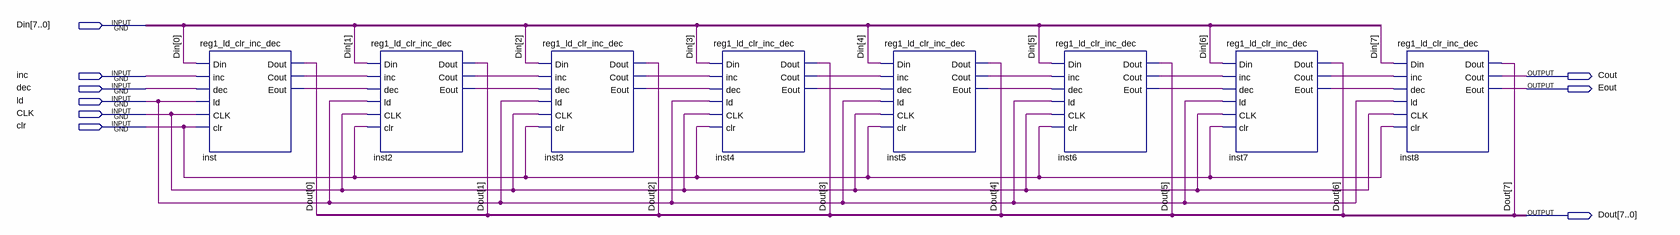
[diagram p0: schematic sheet]
// Quartus schematic reg8_ld_clr_inc_dec.bdf as structural Verilog: 8 symbols, 9 pins
module reg8_ld_clr_inc_dec (
  input  [7:0] Din,
  input  inc,
  input  dec,
  input  ld,
  input  CLK,
  input  clr,
  output Cout,
  output Eout,
  output [7:0] Dout
);

  wire inst2_cout, inst2_eout, inst3_cout, inst3_eout, inst4_cout, inst4_eout, inst5_cout, inst5_eout,
       inst6_cout, inst6_eout, inst7_cout, inst7_eout, inst_cout, inst_eout;

  reg1_ld_clr_inc_dec inst (
    .inc(inc), .Din(Din[0]), .ld(ld), .dec(dec), .CLK(CLK), .clr(clr), .Dout(Dout[0]), .Cout(inst_cout),
    .Eout(inst_eout));
  reg1_ld_clr_inc_dec inst2 (
    .inc(inst_cout), .Din(Din[1]), .ld(ld), .dec(inst_eout), .CLK(CLK), .clr(clr), .Dout(Dout[1]),
    .Cout(inst2_cout), .Eout(inst2_eout));
  reg1_ld_clr_inc_dec inst3 (
    .inc(inst2_cout), .Din(Din[2]), .ld(ld), .dec(inst2_eout), .CLK(CLK), .clr(clr), .Dout(Dout[2]),
    .Cout(inst3_cout), .Eout(inst3_eout));
  reg1_ld_clr_inc_dec inst4 (
    .inc(inst3_cout), .Din(Din[3]), .ld(ld), .dec(inst3_eout), .CLK(CLK), .clr(clr), .Dout(Dout[3]),
    .Cout(inst4_cout), .Eout(inst4_eout));
  reg1_ld_clr_inc_dec inst5 (
    .inc(inst4_cout), .Din(Din[4]), .ld(ld), .dec(inst4_eout), .CLK(CLK), .clr(clr), .Dout(Dout[4]),
    .Cout(inst5_cout), .Eout(inst5_eout));
  reg1_ld_clr_inc_dec inst6 (
    .inc(inst5_cout), .Din(Din[5]), .ld(ld), .dec(inst5_eout), .CLK(CLK), .clr(clr), .Dout(Dout[5]),
    .Cout(inst6_cout), .Eout(inst6_eout));
  reg1_ld_clr_inc_dec inst7 (
    .inc(inst6_cout), .Din(Din[6]), .ld(ld), .dec(inst6_eout), .CLK(CLK), .clr(clr), .Dout(Dout[6]),
    .Cout(inst7_cout), .Eout(inst7_eout));
  reg1_ld_clr_inc_dec inst8 (
    .inc(inst7_cout), .Din(Din[7]), .ld(ld), .dec(inst7_eout), .CLK(CLK), .clr(clr), .Dout(Dout[7]),
    .Cout(Cout), .Eout(Eout));
endmodule
